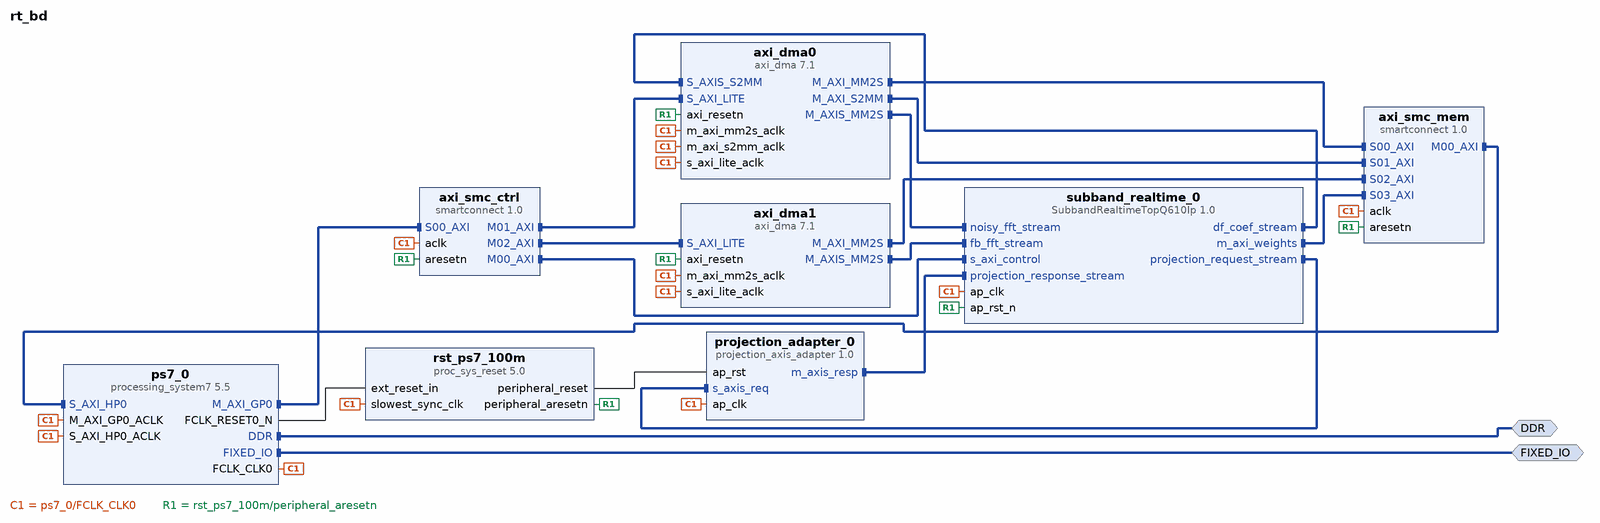
[diagram p0: block diagram of the top level]
# Vivado block design rt_bd, xc7z020clg400-1, Vivado 2023.2
create_bd_design rt_bd

create_bd_intf_port -mode Master -vlnv xilinx.com:interface:ddrx_rtl:1.0 DDR
create_bd_intf_port -mode Master -vlnv xilinx.com:display_processing_system7:fixedio_rtl:1.0 FIXED_IO

create_bd_cell -type ip -vlnv xilinx.com:ip:processing_system7:5.5 ps7_0
set_property -dict [list \
  CONFIG.PCW_FPGA0_PERIPHERAL_FREQMHZ 100.0 \
  CONFIG.PCW_QSPI_PERIPHERAL_ENABLE 0 \
  CONFIG.PCW_SD0_PERIPHERAL_ENABLE 0 \
  CONFIG.PCW_USE_S_AXI_HP0 1 \
] [get_bd_cells ps7_0]
# 33 more settings of ps7_0 are not shown: defaults, MIO pin electricals, DDR timing, and values the tool derives
create_bd_cell -type ip -vlnv xilinx.com:hls:SubbandRealtimeTopQ610Ip:1.0 subband_realtime_0
create_bd_cell -type ip -vlnv user.org:subband:projection_axis_adapter:1.0 projection_adapter_0
create_bd_cell -type ip -vlnv xilinx.com:ip:axi_dma:7.1 axi_dma0
set_property -dict [list \
  CONFIG.c_addr_width 32 \
  CONFIG.c_include_mm2s 1 \
  CONFIG.c_include_s2mm 1 \
  CONFIG.c_include_sg 0 \
  CONFIG.c_m_axis_mm2s_tdata_width 16 \
  CONFIG.c_s_axis_s2mm_tdata_width 16 \
] [get_bd_cells axi_dma0]
create_bd_cell -type ip -vlnv xilinx.com:ip:axi_dma:7.1 axi_dma1
set_property -dict [list \
  CONFIG.c_addr_width 32 \
  CONFIG.c_include_mm2s 1 \
  CONFIG.c_include_s2mm 0 \
  CONFIG.c_include_sg 0 \
  CONFIG.c_m_axis_mm2s_tdata_width 16 \
] [get_bd_cells axi_dma1]
create_bd_cell -type ip -vlnv xilinx.com:ip:smartconnect:1.0 axi_smc_ctrl
set_property -dict {CONFIG.NUM_MI 3 CONFIG.NUM_SI 1} [get_bd_cells axi_smc_ctrl]
create_bd_cell -type ip -vlnv xilinx.com:ip:smartconnect:1.0 axi_smc_mem
set_property -dict {CONFIG.NUM_MI 1 CONFIG.NUM_SI 4} [get_bd_cells axi_smc_mem]
create_bd_cell -type ip -vlnv xilinx.com:ip:proc_sys_reset:5.0 rst_ps7_100m

# ---- connections ----

connect_bd_intf_net [get_bd_intf_pins axi_dma0/M_AXIS_MM2S] [get_bd_intf_pins subband_realtime_0/noisy_fft_stream]
connect_bd_intf_net [get_bd_intf_pins axi_dma0/M_AXI_MM2S] [get_bd_intf_pins axi_smc_mem/S00_AXI]
connect_bd_intf_net [get_bd_intf_pins axi_dma0/M_AXI_S2MM] [get_bd_intf_pins axi_smc_mem/S01_AXI]
connect_bd_intf_net [get_bd_intf_pins axi_dma1/M_AXIS_MM2S] [get_bd_intf_pins subband_realtime_0/fb_fft_stream]
connect_bd_intf_net [get_bd_intf_pins axi_dma1/M_AXI_MM2S] [get_bd_intf_pins axi_smc_mem/S02_AXI]
connect_bd_intf_net [get_bd_intf_pins axi_smc_ctrl/M00_AXI] [get_bd_intf_pins subband_realtime_0/s_axi_control]
connect_bd_intf_net [get_bd_intf_pins axi_smc_ctrl/M01_AXI] [get_bd_intf_pins axi_dma0/S_AXI_LITE]
connect_bd_intf_net [get_bd_intf_pins axi_smc_ctrl/M02_AXI] [get_bd_intf_pins axi_dma1/S_AXI_LITE]
connect_bd_intf_net [get_bd_intf_pins axi_smc_mem/M00_AXI] [get_bd_intf_pins ps7_0/S_AXI_HP0]
connect_bd_intf_net [get_bd_intf_pins projection_adapter_0/m_axis_resp] [get_bd_intf_pins subband_realtime_0/projection_response_stream]
connect_bd_intf_net [get_bd_intf_ports DDR] [get_bd_intf_pins ps7_0/DDR]
connect_bd_intf_net [get_bd_intf_ports FIXED_IO] [get_bd_intf_pins ps7_0/FIXED_IO]
connect_bd_intf_net [get_bd_intf_pins ps7_0/M_AXI_GP0] [get_bd_intf_pins axi_smc_ctrl/S00_AXI]
connect_bd_intf_net [get_bd_intf_pins subband_realtime_0/df_coef_stream] [get_bd_intf_pins axi_dma0/S_AXIS_S2MM]
connect_bd_intf_net [get_bd_intf_pins subband_realtime_0/m_axi_weights] [get_bd_intf_pins axi_smc_mem/S03_AXI]
connect_bd_intf_net [get_bd_intf_pins subband_realtime_0/projection_request_stream] [get_bd_intf_pins projection_adapter_0/s_axis_req]
connect_bd_net [get_bd_pins ps7_0/FCLK_CLK0] \
  [get_bd_pins rst_ps7_100m/slowest_sync_clk] [get_bd_pins ps7_0/M_AXI_GP0_ACLK] [get_bd_pins ps7_0/S_AXI_HP0_ACLK] \
  [get_bd_pins subband_realtime_0/ap_clk] [get_bd_pins projection_adapter_0/ap_clk] [get_bd_pins axi_smc_ctrl/aclk] \
  [get_bd_pins axi_smc_mem/aclk] [get_bd_pins axi_dma0/s_axi_lite_aclk] [get_bd_pins axi_dma0/m_axi_mm2s_aclk] \
  [get_bd_pins axi_dma0/m_axi_s2mm_aclk] [get_bd_pins axi_dma1/s_axi_lite_aclk] [get_bd_pins axi_dma1/m_axi_mm2s_aclk]
connect_bd_net [get_bd_pins ps7_0/FCLK_RESET0_N] [get_bd_pins rst_ps7_100m/ext_reset_in]
connect_bd_net [get_bd_pins rst_ps7_100m/peripheral_aresetn] \
  [get_bd_pins subband_realtime_0/ap_rst_n] [get_bd_pins axi_smc_ctrl/aresetn] [get_bd_pins axi_smc_mem/aresetn] \
  [get_bd_pins axi_dma0/axi_resetn] [get_bd_pins axi_dma1/axi_resetn]
connect_bd_net [get_bd_pins rst_ps7_100m/peripheral_reset] [get_bd_pins projection_adapter_0/ap_rst]

# ---- address map ----
assign_bd_address -offset 0x00000000 -range 512M -target_address_space [get_bd_addr_spaces axi_dma0/Data_MM2S] [get_bd_addr_segs ps7_0/S_AXI_HP0/HP0_DDR_LOWOCM]
assign_bd_address -offset 0x00000000 -range 512M -target_address_space [get_bd_addr_spaces axi_dma0/Data_S2MM] [get_bd_addr_segs ps7_0/S_AXI_HP0/HP0_DDR_LOWOCM]
assign_bd_address -offset 0x00000000 -range 512M -target_address_space [get_bd_addr_spaces axi_dma1/Data_MM2S] [get_bd_addr_segs ps7_0/S_AXI_HP0/HP0_DDR_LOWOCM]
assign_bd_address -offset 0x40000000 -range 64K -target_address_space [get_bd_addr_spaces ps7_0/Data] [get_bd_addr_segs subband_realtime_0/s_axi_control/Reg]
assign_bd_address -offset 0x41E00000 -range 64K -target_address_space [get_bd_addr_spaces ps7_0/Data] [get_bd_addr_segs axi_dma0/S_AXI_LITE/Reg]
assign_bd_address -offset 0x41E10000 -range 64K -target_address_space [get_bd_addr_spaces ps7_0/Data] [get_bd_addr_segs axi_dma1/S_AXI_LITE/Reg]
assign_bd_address -offset 0x00000000 -range 512M -target_address_space [get_bd_addr_spaces subband_realtime_0/Data_m_axi_weights] [get_bd_addr_segs ps7_0/S_AXI_HP0/HP0_DDR_LOWOCM]

validate_bd_design
save_bd_design
